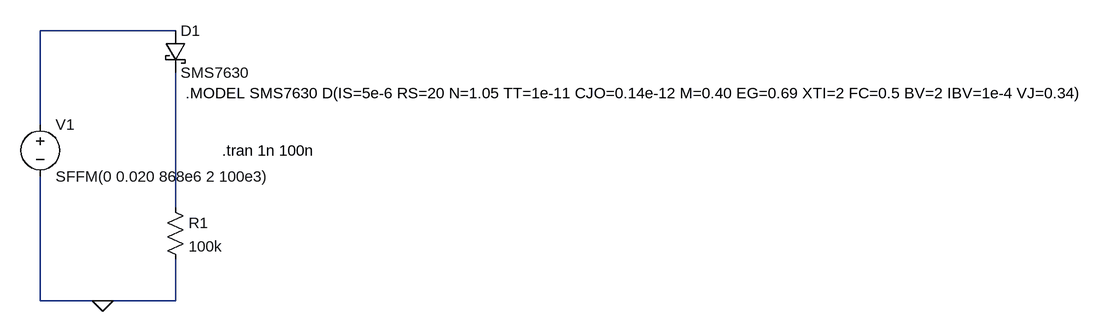
[diagram p0: schematic Draft1.asc]
Draft1.asc, the LTspice schematic file:
Version 4
SHEET 1 1768 680
WIRE 368 96 160 96
WIRE 160 240 160 96
WIRE 368 368 368 160
WIRE 160 512 160 320
WIRE 256 512 160 512
WIRE 368 512 368 448
WIRE 368 512 256 512
FLAG 256 512 0
SYMBOL voltage 160 224 R0
SYMATTR InstName V1
SYMATTR Value SFFM(0 0.020 868e6 2 100e3)
SYMATTR Value2 AC 0 0
SYMATTR SpiceLine Rser=50
SYMBOL res 352 352 R0
SYMATTR InstName R1
SYMATTR Value 100k
SYMBOL schottky 352 96 R0
SYMATTR InstName D1
SYMATTR Value SMS7630
TEXT 440 280 Left 2 !.tran 1n 100n
TEXT 384 192 Left 2 !.MODEL SMS7630 D(IS=5e-6 RS=20 N=1.05 TT=1e-11 CJO=0.14e-12 M=0.40 EG=0.69 XTI=2 FC=0.5 BV=2 IBV=1e-4 VJ=0.34)

The netlist it stands for:
* Draft1.asc
V1 N001 0 SFFM(0 0.020 868e6 2 100e3) AC 0 0 Rser=50
R1 N002 0 100k
D1 N001 N002 SMS7630
.model D D
.lib standard.dio
.tran 1n 100n
.MODEL SMS7630 D(IS=5e-6 RS=20 N=1.05 TT=1e-11 CJO=0.14e-12 M=0.40 EG=0.69 XTI=2 FC=0.5 BV=2 IBV=1e-4 VJ=0.34)
.backanno
.end